# Altium schematic sheet Main.SchDoc
size A4
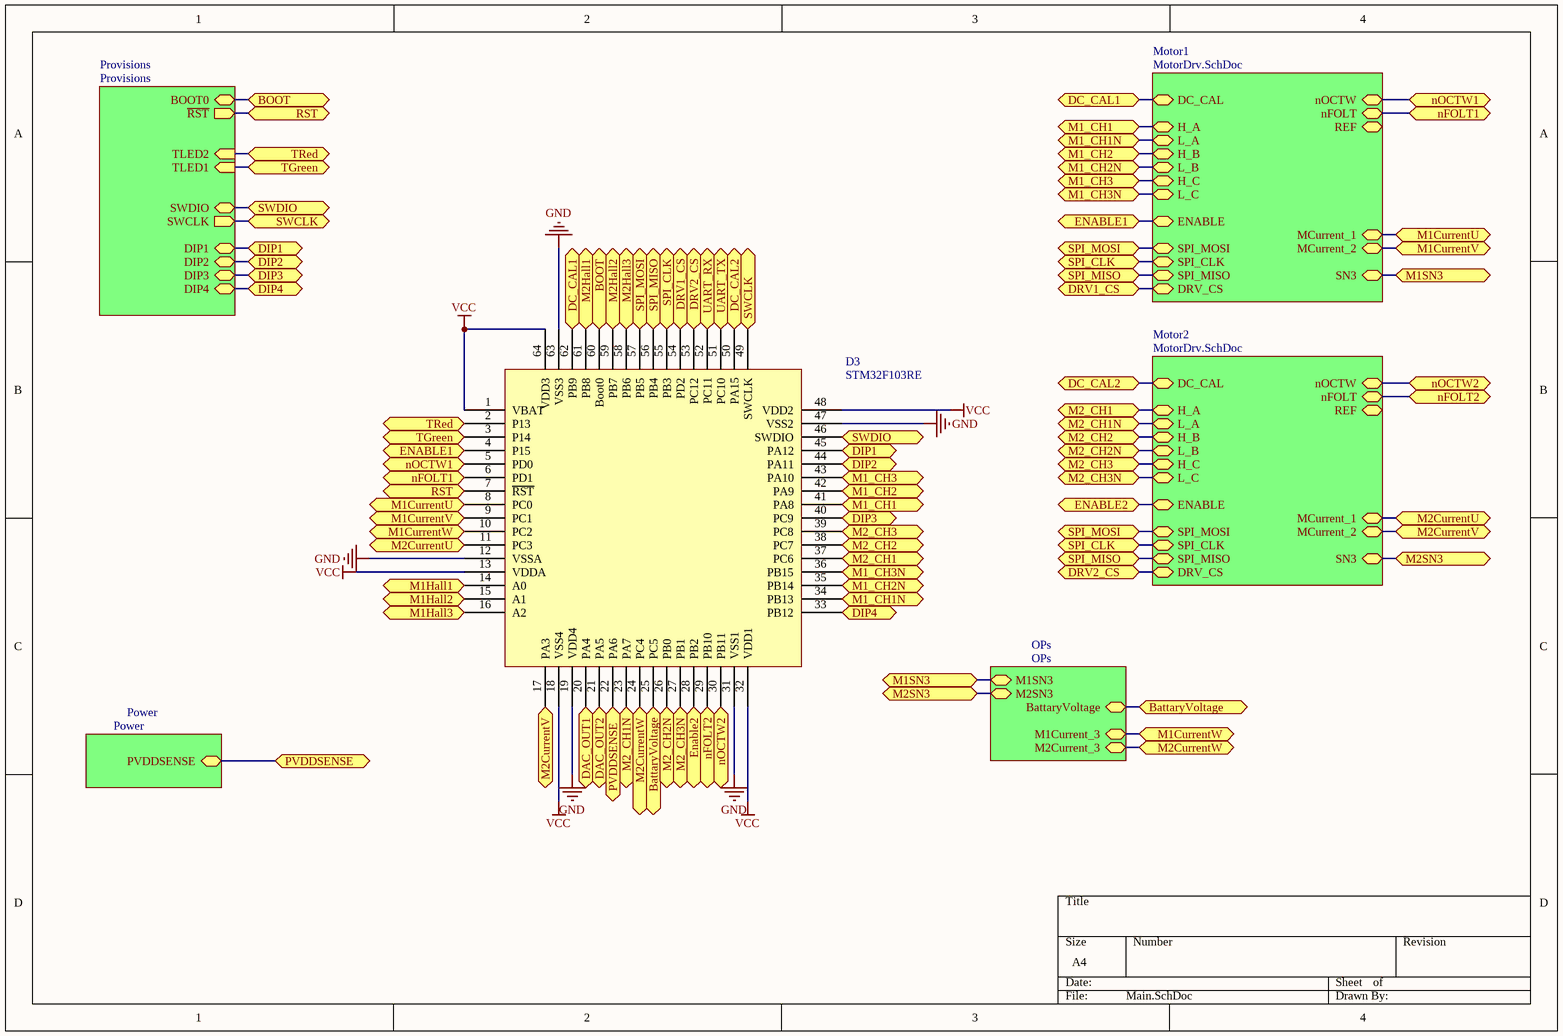
[diagram p0: Main.SchDoc]

## Parts
D3  STM32F103RE  [LQFP64_N]

## Sub-sheets
Motor1 = MotorDrv.SchDoc: DRV_CS, H_A, H_C, DC_CAL, L_A, H_B, ENABLE, SPI_MOSI, SPI_CLK, nOCTW, REF, nFOLT, L_B, L_C, SPI_MISO, MCurrent_1, MCurrent_2, SN3
Motor2 = MotorDrv.SchDoc: DRV_CS, H_A, H_C, DC_CAL, L_A, H_B, ENABLE, SPI_MOSI, SPI_CLK, nOCTW, REF, nFOLT, L_B, L_C, SPI_MISO, MCurrent_1, MCurrent_2, SN3
OPs = OPs: BattaryVoltage, M2SN3, M2Current_3, M1SN3, M1Current_3
Power = Power: PVDDSENSE
Provisions = Provisions: BOOT0, SWCLK (out), TLED2 (in), TLED1 (in), SWDIO, ~{RST} (out), DIP3, DIP4, DIP2, DIP1

## Ports
BattaryVoltage, BOOT, DAC_OUT1, DAC_OUT2, DC_CAL1, DC_CAL2, DIP1, DIP2, DIP3, DIP4, DRV1_CS, DRV2_CS, ENABLE1, Enable2, ENABLE2, M1_CH1, M1_CH1N, M1_CH2, M1_CH2N, M1_CH3, M1_CH3N, M1CurrentU, M1CurrentV, M1CurrentW, M1Hall1, M1Hall2, M1Hall3, M1SN3, M2_CH1, M2_CH1N, M2_CH2, M2_CH2N, M2_CH3, M2_CH3N, M2CurrentU, M2CurrentV, M2CurrentW, M2Hall1, M2Hall2, M2Hall3, M2SN3, nFOLT1, nFOLT2, nOCTW1, nOCTW2, PVDDSENSE, RST, SPI_CLK, SPI_MISO, SPI_MOSI, SWCLK, SWDIO, TGreen, TRed, UART_RX, UART_TX

## Nets
GND: D3.12(VSSA) D3.19(VDD4) D3.31(VSS1) D3.47(VSS2) D3.63(VSS3)
VCC: D3.1(VBAT) D3.13(VDDA) D3.18(VSS4) D3.32(VDD1) D3.48(VDD2) D3.64(VDD3)
BattaryVoltage: D3.25(PC5) ; port BattaryVoltage, sheet OPs/BattaryVoltage
BOOT: D3.60(Boot0) ; port BOOT, sheet Provisions/BOOT0
DAC_OUT1: D3.20(PA4) ; port DAC_OUT1
DAC_OUT2: D3.21(PA5) ; port DAC_OUT2
DC_CAL1: D3.62(PB9) ; port DC_CAL1, sheet Motor1/DC_CAL
DC_CAL2: D3.50(PA15) ; port DC_CAL2, sheet Motor2/DC_CAL
DIP1: D3.45(PA12) ; port DIP1, sheet Provisions/DIP1
DIP2: D3.44(PA11) ; port DIP2, sheet Provisions/DIP2
DIP3: D3.40(PC9) ; port DIP3, sheet Provisions/DIP3
DIP4: D3.33(PB12) ; port DIP4, sheet Provisions/DIP4
DRV1_CS: D3.54(PD2) ; port DRV1_CS, sheet Motor1/DRV_CS
DRV2_CS: D3.53(PC12) ; port DRV2_CS, sheet Motor2/DRV_CS
ENABLE1: D3.4(P15) ; port ENABLE1, sheet Motor1/ENABLE
Enable2: D3.28(PB2) ; port Enable2, port ENABLE2, sheet Motor2/ENABLE
M1_CH1: D3.41(PA8) ; port M1_CH1, sheet Motor1/H_A
M1_CH1N: D3.34(PB13) ; port M1_CH1N, sheet Motor1/L_A
M1_CH2: D3.42(PA9) ; port M1_CH2, sheet Motor1/H_B
M1_CH2N: D3.35(PB14) ; port M1_CH2N, sheet Motor1/L_B
M1_CH3: D3.43(PA10) ; port M1_CH3, sheet Motor1/H_C
M1_CH3N: D3.36(PB15) ; port M1_CH3N, sheet Motor1/L_C
M1CurrentU: D3.8(PC0) ; port M1CurrentU, sheet Motor1/MCurrent_1
M1CurrentV: D3.9(PC1) ; port M1CurrentV, sheet Motor1/MCurrent_2
M1CurrentW: D3.10(PC2) ; port M1CurrentW, sheet OPs/M1Current_3
M1Hall1: D3.14(A0) ; port M1Hall1
M1Hall2: D3.15(A1) ; port M1Hall2
M1Hall3: D3.16(A2) ; port M1Hall3
M1SN3: port M1SN3, sheet Motor1/SN3, sheet OPs/M1SN3
M2_CH1: D3.37(PC6) ; port M2_CH1, sheet Motor2/H_A
M2_CH1N: D3.23(PA7) ; port M2_CH1N, sheet Motor2/L_A
M2_CH2: D3.38(PC7) ; port M2_CH2, sheet Motor2/H_B
M2_CH2N: D3.26(PB0) ; port M2_CH2N, sheet Motor2/L_B
M2_CH3: D3.39(PC8) ; port M2_CH3, sheet Motor2/H_C
M2_CH3N: D3.27(PB1) ; port M2_CH3N, sheet Motor2/L_C
M2CurrentU: D3.11(PC3) ; port M2CurrentU, sheet Motor2/MCurrent_1
M2CurrentV: D3.17(PA3) ; port M2CurrentV, sheet Motor2/MCurrent_2
M2CurrentW: D3.24(PC4) ; port M2CurrentW, sheet OPs/M2Current_3
M2Hall1: D3.61(PB8) ; port M2Hall1
M2Hall2: D3.59(PB7) ; port M2Hall2
M2Hall3: D3.58(PB6) ; port M2Hall3
M2SN3: port M2SN3, sheet Motor2/SN3, sheet OPs/M2SN3
nFOLT1: D3.6(PD1) ; port nFOLT1, sheet Motor1/nFOLT
nFOLT2: D3.29(PB10) ; port nFOLT2, sheet Motor2/nFOLT
nOCTW1: D3.5(PD0) ; port nOCTW1, sheet Motor1/nOCTW
nOCTW2: D3.30(PB11) ; port nOCTW2, sheet Motor2/nOCTW
PVDDSENSE: D3.22(PA6) ; port PVDDSENSE, sheet Power/PVDDSENSE
RST: D3.7(~{RST}) ; port RST, sheet Provisions/~{RST}
SPI_CLK: D3.55(PB3) ; port SPI_CLK, sheet Motor1/SPI_CLK, sheet Motor2/SPI_CLK
SPI_MISO: D3.56(PB4) ; port SPI_MISO, sheet Motor1/SPI_MISO, sheet Motor2/SPI_MISO
SPI_MOSI: D3.57(PB5) ; port SPI_MOSI, sheet Motor1/SPI_MOSI, sheet Motor2/SPI_MOSI
SWCLK: D3.49(SWCLK) ; port SWCLK, sheet Provisions/SWCLK
SWDIO: D3.46(SWDIO) ; port SWDIO, sheet Provisions/SWDIO
TGreen: D3.3(P14) ; port TGreen, sheet Provisions/TLED1
TRed: D3.2(P13) ; port TRed, sheet Provisions/TLED2
UART_RX: D3.52(PC11) ; port UART_RX
UART_TX: D3.51(PC10) ; port UART_TX

## Library data of the parts
D3 = STM32F103RE: High-density performance line ARM®-based 32-bit MCU with 256 to 512KB  Flash, USB, CAN, 11 timers, 3 ADCs, 13 communication interfaces